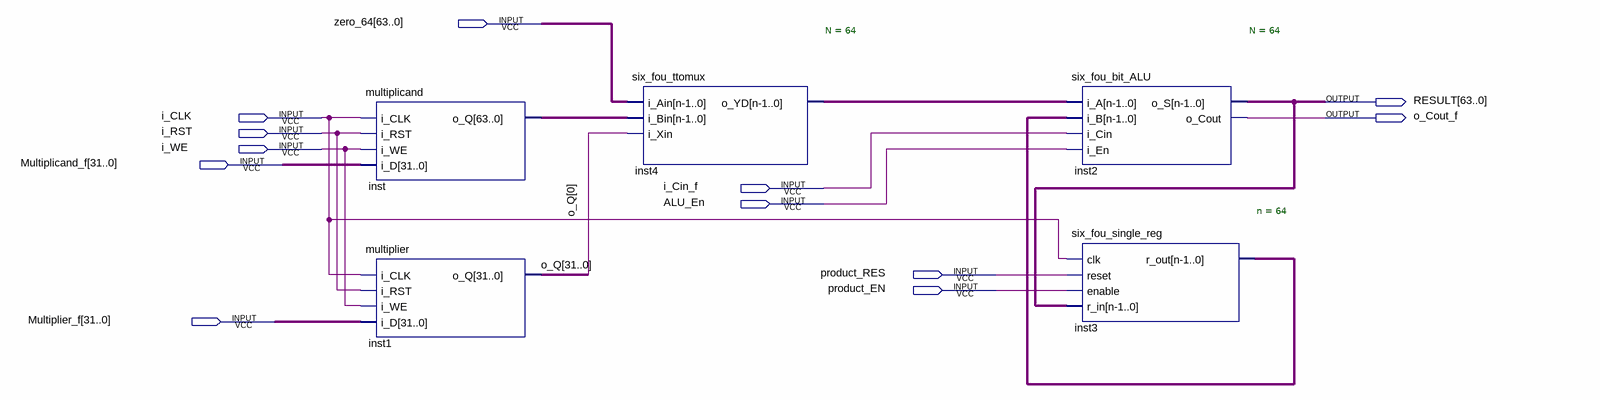
[diagram p0: schematic sheet]
// Quartus schematic lab6.bdf as structural Verilog: 5 symbols, 12 pins
module lab6 (
  input  [63:0] zero_64,
  input  i_CLK,
  input  i_RST,
  input  i_WE,
  input  [31:0] Multiplicand_f,
  input  i_Cin_f,
  input  ALU_En,
  input  product_RES,
  input  product_EN,
  input  [31:0] Multiplier_f,
  output [63:0] RESULT,
  output o_Cout_f
);

  wire [31:0] o_Q;
  wire [63:0] inst3_r_out, inst4_o_yd, inst_o_q;

  multiplicand inst (.i_CLK(i_CLK), .i_RST(i_RST), .i_WE(i_WE), .i_D(Multiplicand_f), .o_Q(inst_o_q));
  multiplier inst1 (.i_CLK(i_CLK), .i_RST(i_RST), .i_WE(i_WE), .i_D(Multiplier_f), .o_Q(o_Q));
  six_fou_ttomux #(.N(64)) inst4 (.i_Ain(zero_64), .i_Bin(inst_o_q), .i_Xin(o_Q[0]), .o_YD(inst4_o_yd));
  six_fou_bit_ALU #(.N(64)) inst2 (
    .i_A(inst4_o_yd), .i_B(inst3_r_out), .i_Cin(i_Cin_f), .i_En(ALU_En), .o_S(RESULT), .o_Cout(o_Cout_f));
  six_fou_single_reg #(.n(64)) inst3 (
    .clk(i_CLK), .reset(product_RES), .enable(product_EN), .r_in(RESULT), .r_out(inst3_r_out));
endmodule
